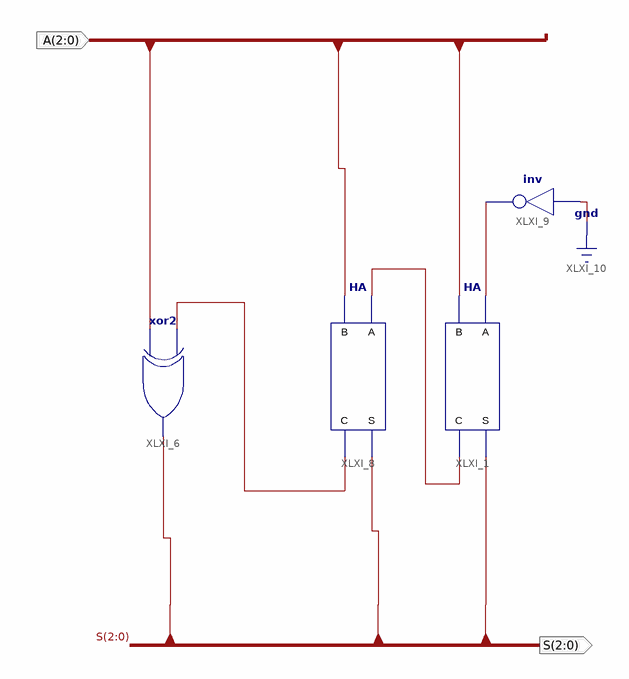
[diagram p0: schematic sheet 1]
// Xilinx ISE schematic ADDER_3_bit.sch (spartan3e) as structural Verilog: 4 symbols, 2 ports
module ADDER_3_bit (
  input  [2:0] A,
  output [2:0] S
);

  wire XLXN_10, XLXN_15, XLXN_22;

  HA XLXI_1 (.A(XLXN_15), .B(A[0]), .C(XLXN_22), .S(S[0]));
  xor XLXI_6 (S[2], A[2], XLXN_10);
  HA XLXI_8 (.A(XLXN_22), .B(A[1]), .C(XLXN_10), .S(S[1]));
  not XLXI_9 (XLXN_15, 1'b0);
endmodule
